# Altium schematic sheet pca63557_sheet1_connectors.SchDoc: =BoardTitle
size A4; Organization: Nordic Semiconductor; DocumentNumber: 1; SheetNumber: 1; SheetTotal: 4; CompanyName: Nordic Semiconductor; DocumentSize: A4
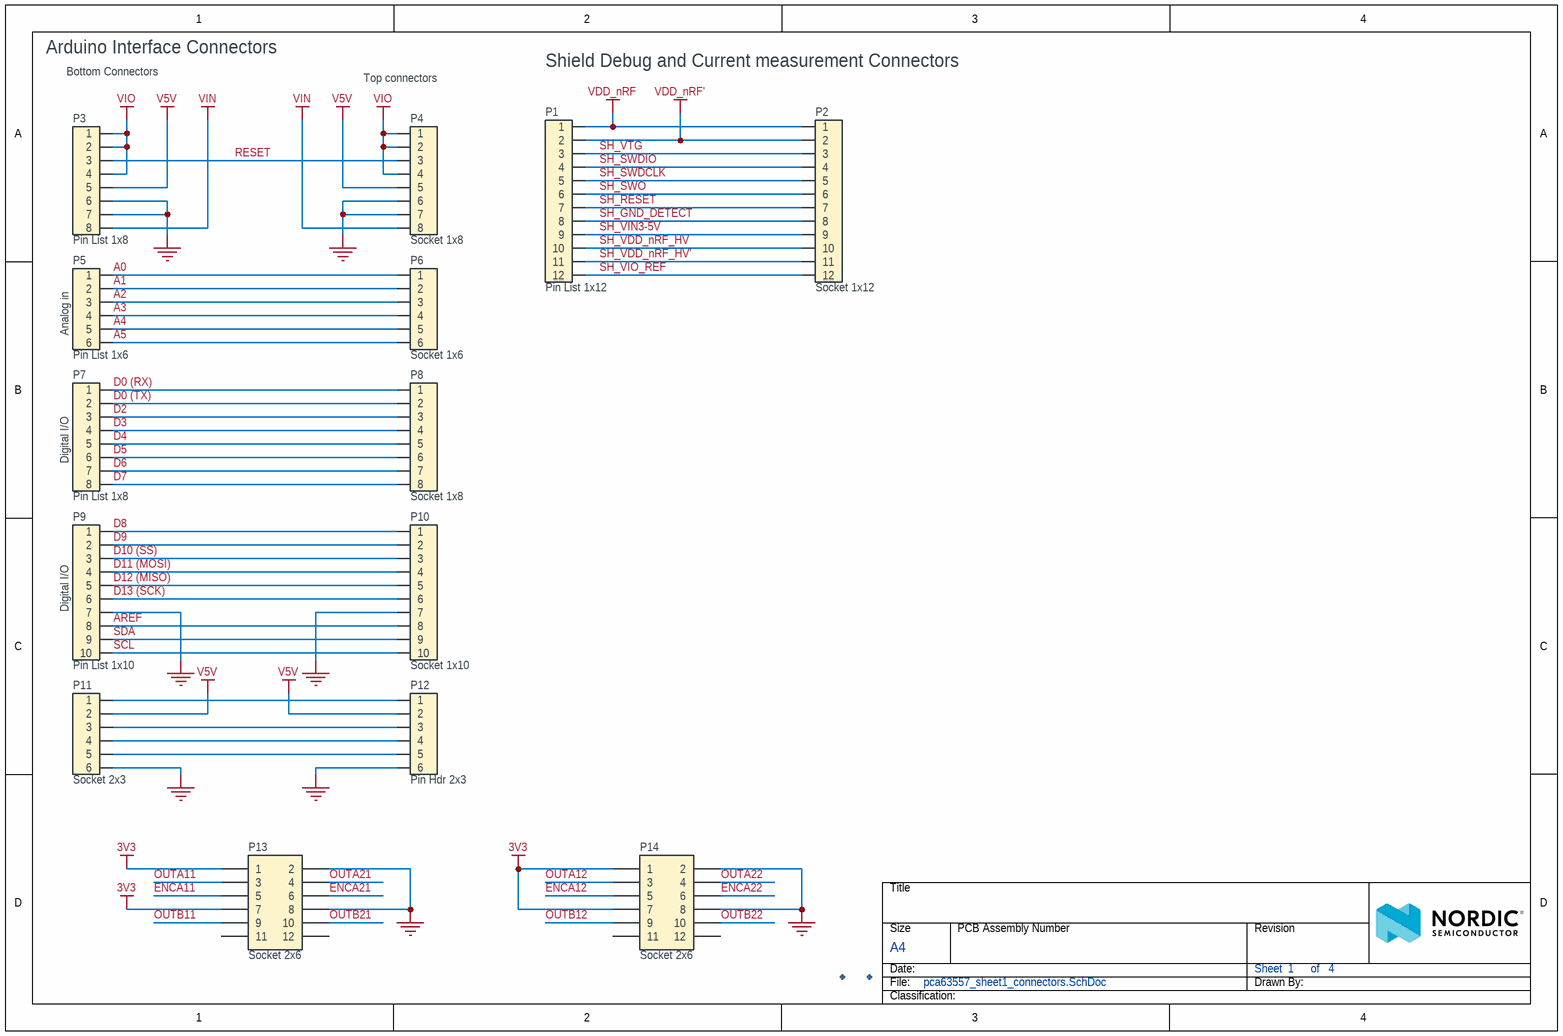
[diagram p0: pca63557_sheet1_connectors.SchDoc]

## Parts
Fid1  Fiducial mark  [Fiducial]  (value not drawn)
Fid2  Fiducial mark  [Fiducial]  (value not drawn)
P1  Pin List 1x12  [LIST_1x12_SMD]
P2  Socket 1x12  [SOCKET_1x12_SMD]
P3  Pin List 1x8  [LIST_1x8_SMD]
P4  Socket 1x8  [SOCKET_1x8_SMD]
P5  Pin List 1x6  [LIST_1x6_SMD]
P6  Socket 1x6  [SOCKET_1x6_SMD]
P7  Pin List 1x8  [LIST_1x8_SMD]
P8  Socket 1x8  [SOCKET_1x8_SMD]
P9  Pin List 1x10  [LIST_1x10_SMD]
P10  Socket 1x10  [SOCKET_1x10_SMD]
P11  Socket 2x3  [SOCKET_2x3_SMD-2.54mm-bottom]
P12  Pin Hdr 2x3  [HDR_2x3-SMD]
P13  Socket 2x6  [SOCKET_2x6_TH_ANG_2.54]
P14  Socket 2x6  [SOCKET_2x6_TH_ANG_2.54]

## Nets
3V3: P13.1 P13.7 P14.1 P14.7
GND: P3.6 P3.7 P4.6 P4.7 P9.7 P10.7 P11.6 P12.6 P13.2 P13.8 P14.2 P14.8
V5V: P3.5 P4.5 P11.2 P12.2
VDD_nRF: P1.1 P2.1
VDD_nRF': P1.2 P2.2
VIN: P3.8 P4.8
VIO: P3.1 P3.2 P3.4 P4.1 P4.2 P4.4
A0: P5.1 P6.1
A1: P5.2 P6.2
A2: P5.3 P6.3
A3: P5.4 P6.4
A4: P5.5 P6.5
A5: P5.6 P6.6
AREF: P9.8 P10.8
D0 (RX): P7.1 P8.1
D0 (TX): P7.2 P8.2
D2: P7.3 P8.3
D3: P7.4 P8.4
D4: P7.5 P8.5
D5: P7.6 P8.6
D6: P7.7 P8.7
D7: P7.8 P8.8
D8: P9.1 P10.1
D9: P9.2 P10.2
D10 (SS): P9.3 P10.3
D11 (MOSI): P9.4 P10.4
D12 (MISO): P9.5 P10.5
D13 (SCK): P9.6 P10.6
ENCA11: P13.5
ENCA12: P14.5
ENCA21: P13.6
ENCA22: P14.6
OUTA11: P13.3
OUTA12: P14.3
OUTA21: P13.4
OUTA22: P14.4
OUTB11: P13.9
OUTB12: P14.9
OUTB21: P13.10
OUTB22: P14.10
RESET: P3.3 P4.3
SCL: P9.10 P10.10
SDA: P9.9 P10.9
SH_GND_DETECT: P1.8 P2.8
SH_RESET: P1.7 P2.7
SH_SWDCLK: P1.5 P2.5
SH_SWDIO: P1.4 P2.4
SH_SWO: P1.6 P2.6
SH_VDD_nRF_HV: P1.10 P2.10
SH_VDD_nRF_HV': P1.11 P2.11
SH_VIN3-5V: P1.9 P2.9
SH_VIO_REF: P1.12 P2.12
SH_VTG: P1.3 P2.3
NetP11_1: P11.1 P12.1
NetP11_3: P11.3 P12.3
NetP11_4: P11.4 P12.4
NetP11_5: P11.5 P12.5

Not connected (* = marked no-connect by the designer): P13 11 12; P14 11 12

## Notes on the sheet
- Arduino Interface Connectors
- Bottom Connectors
- (near P4) Top connectors
- Shield Debug and Current measurement Connectors
- (near P5) Analog in
- (near P7) Digital I/O
- (near P9) Digital I/O
- Title
- Size
- Date:
- File:
- A4
- PCB Assembly Number
- Sheet         of
- Drawn By:
- Revision
- Classification:

## Library data of the parts
Fid1 Fid2 = Fid-Mark: Manufacturer: N.A.; Part number NEMS: 100500073; Value: N.A.; Pad Count: 1; Component Status: Active; Part Number: Fid-Mark; Manufacturer Part Number: N.A.; LatestRevisionDate: 2009-12-12; Published: 2009-12-12; Note: N.A.; Artikkelnr Noca: N.A.; Footprint Doc: Fiducial; PartId: 100500073; Component Class: Connectors; Author: rsk; ComponentLink1URL: N.A.; ComponentLink1Description: Datasheet; ComponentLink2URL: N.A.; ComponentLink2Description: Supplier link; HelpURL: N.A.; Supplier 1: N.A.; Supplier Part Number 1: N.A.; Supplier 2: N.A.; Supplier Part Number 2: N.A.; Part number IPS: N.A.; Part number Norautron: N.A.
P1 = Pin List 1x12 SMD: Pin List 1x12, 2.54mm (100mil), SMD; Manufacturer: W-CON; Manufacturer Part Number: 1125-1112S0M116R2; Part number IPS: 00000009969; Part number NEMS: 100500343; Component Status: Active; Pad Count: 12; Note: N.A.; Artikkelnr Noca: 55019293; Part Number: Pin List 1x12 SMD; PartId: 100500343; Component Class: Connectors; Author: rsk; ComponentLink1URL: N.A.; ComponentLink1Description: Datasheet; ComponentLink2URL: N.A.; ComponentLink2Description: Supplier link; HelpURL: N.A.; Footprint Doc: LIST_1x12_SMD; LatestRevisionDate: 2017-10-23; Published: 2015-11-10; Value: Pin List 1x12; Supplier 1: Cabcon; Supplier Part Number 1: 1125-1112S0M116R2; Supplier 2: Samtec; Supplier Part Number 2: TSM-112-01-L-SV-P-TR; Part number Norautron: N.A.
P2 = Socket 1x12 SMD: Socket 1x12, 2.54mm (100mil), SMD; Manufacturer: W-CON; Manufacturer Part Number: 2171-112MS0CUNR1; Part number NEMS: 100500420; Component Status: Active; Pad Count: 12; Note: N.A.; Part Number: Socket 1x12 SMD; PartId: 100500420; Component Class: Connectors; Author: rsk; ComponentLink1URL: N.A.; ComponentLink1Description: Datasheet; ComponentLink2URL: N.A.; ComponentLink2Description: Supplier link; HelpURL: N.A.; Footprint Doc: SOCKET_1x12_SMD; LatestRevisionDate: 2017-10-23; Published: 2016-07-07; Value: Socket 1x12; Supplier 1: Cabcon; Supplier Part Number 1: 2171-112MS0CUNR1; Supplier 2: Samtec; Supplier Part Number 2: SSM-112-L-SV-P-TR; Artikkelnr Noca: N.A.; Part number IPS: N.A.; Part number Norautron: N.A.
P3 P7 = Pin List 1x8 SMD: Pin List 1x8, 2.54mm (100mil), SMD; Manufacturer: W-CON; Manufacturer Part Number: 1125-1108S0M116R2; Part number IPS: 00000001701; Part number NEMS: 100500329; Note: N.A.; Artikkelnr Noca: 55010006; Component Status: Active; Pad Count: 8; Part Number: Pin List 1x8 SMD; LatestRevisionDate: 2016-01-22; Published: 2016-01-22; Value: Pin List 1x8; Footprint Doc: LIST_1x8_SMD; PartId: 100500329; Component Class: Connectors; Author: rsk; ComponentLink1URL: N.A.; ComponentLink1Description: Datasheet; ComponentLink2URL: N.A.; ComponentLink2Description: Supplier link; HelpURL: \\hizz\pro\app9717\Datasheet\connectors\W-CON\1125-11XXXXMXXXXX.pdf; Supplier 1: Cabcon; Supplier Part Number 1: 1125-1108S0M116R2; Supplier 2: Samtec; Supplier Part Number 2: TSM-108-01-L-SV-P-TR; Part number Norautron: N.A.
P4 P8 = Socket 1x8 SMD: Socket 1x8, 2.54mm (100mil), SMD; Manufacturer: W-CON; Manufacturer Part Number: 2171-108MS0CUNR1; Part number IPS: 00000009963; Part number Norautron: 26032369; Part number NEMS: 100500412; Note: N.A.; Artikkelnr Noca: 55030002; Component Status: Active; Pad Count: 8; Part Number: Socket 1x8 SMD; LatestRevisionDate: 2017-10-23; Published: 2016-01-22; Value: Socket 1x8; Footprint Doc: SOCKET_1x8_SMD; PartId: 100500412; Component Class: Connectors; Author: rsk; ComponentLink1URL: N.A.; ComponentLink1Description: Datasheet; ComponentLink2URL: N.A.; ComponentLink2Description: Supplier link; HelpURL: N.A.; Supplier 1: Cabcon; Supplier Part Number 1: 2171-108MS0CUNR1; Supplier 2: Samtec; Supplier Part Number 2: SSM-108-F-SV-P-TR
P5 = Pin List 1x6 SMD: Pin List 1x6, 2.54mm (100mil), SMD; Manufacturer: W-CON; Manufacturer Part Number: 1125-1106S0M116R2; Part number NEMS: 100500320; Note: N.A.; Artikkelnr Noca: 55010026; Component Status: Active; Pad Count: 6; Part Number: Pin List 1x6 SMD; LatestRevisionDate: 2016-03-29; Published: 2016-03-29; Value: Pin List 1x6; Footprint Doc: LIST_1x6_SMD; PartId: 100500320; Component Class: Connectors; Author: rsk; ComponentLink1URL: N.A.; ComponentLink1Description: Datasheet; ComponentLink2URL: N.A.; ComponentLink2Description: Supplier link; HelpURL: \\hizz\pro\app9717\Datasheet\connectors\W-CON\1125-11XXXXMXXXXX.pdf; Supplier 1: Cabcon; Supplier Part Number 1: 1125-1106S0M116R2; Supplier 2: Samtec; Supplier Part Number 2: TSM-106-01-L-SV-P-TR; Part number IPS: N.A.; Part number Norautron: N.A.
P6 = Socket 1x6 SMD: Socket 1x6, 2.54mm (100mil), SMD; Manufacturer: W-CON; Manufacturer Part Number: 2171-106MS0CUNR1; Part number IPS: 00000009964; Part number Norautron: 26032370; Part number NEMS: 100500408; Note: N.A.; Artikkelnr Noca: 55030001; Component Status: Active; Pad Count: 6; Part Number: Socket 1x6 SMD; LatestRevisionDate: 2017-10-23; Published: 2016-01-22; Value: Socket 1x6; Footprint Doc: SOCKET_1x6_SMD; PartId: 100500408; Component Class: Connectors; Author: rsk; ComponentLink1URL: N.A.; ComponentLink1Description: Datasheet; ComponentLink2URL: N.A.; ComponentLink2Description: Supplier link; HelpURL: N.A.; Supplier 1: Cabcon; Supplier Part Number 1: 2171-106MS0CUNR1; Supplier 2: Samtec; Supplier Part Number 2: SSM-106-F-SV-P-TR
P9 = Pin List 1x10 SMD: Pin List 1x10, 2.54mm (100mil), SMD; Manufacturer: W-CON; Manufacturer Part Number: 1125-1110S0M116R2; Part number IPS: 00000004906; Part number NEMS: 100500337; Note: N.A.; Artikkelnr Noca: 55010028; Component Status: Active; Pad Count: 10; Part Number: Pin List 1x10 SMD; LatestRevisionDate: 2016-03-29; Published: 2016-03-29; Value: Pin List 1x10; Footprint Doc: LIST_1x10_SMD; PartId: 100500337; Component Class: Connectors; Author: rsk; ComponentLink1URL: N.A.; ComponentLink1Description: Datasheet; ComponentLink2URL: N.A.; ComponentLink2Description: Supplier link; HelpURL: \\hizz\pro\app9717\Datasheet\connectors\W-CON\1125-11XXXXMXXXXX.pdf; Supplier 1: Cabcon; Supplier Part Number 1: 1125-1110S0M116R2; Supplier 2: Samtec; Supplier Part Number 2: TSM-110-01-L-SV-P-TR; Part number Norautron: N.A.
P10 = Socket 1x10 SMD: Socket 1x10, 2.54mm (100mil), SMD; Manufacturer: W-CON; Manufacturer Part Number: 2171-110MS0CUNR1; Part number IPS: 00000009965; Part number Norautron: 26032371; Part number NEMS: 100500416; Note: N.A.; Artikkelnr Noca: 55030004; Component Status: Active; Pad Count: 10; Part Number: Socket 1x10 SMD; LatestRevisionDate: 2016-01-22; Published: 2016-01-22; Value: Socket 1x10; Footprint Doc: SOCKET_1x10_SMD; PartId: 100500416; Component Class: Connectors; Author: rsk; ComponentLink1URL: N.A.; ComponentLink1Description: Datasheet; ComponentLink2URL: N.A.; ComponentLink2Description: Supplier link; HelpURL: N.A.; Supplier 1: Cabcon; Supplier Part Number 1: 2171-110MS0CUNR1; Supplier 2: Samtec; Supplier Part Number 2: SSM-110-F-SV-P-TR
P11 = Socket 2x3 SMD Bottom: Socket 2x3, 2.54mm (100mil), SMD; Manufacturer: W-CON; Manufacturer Part Number: 2171-203MS0CUNR1; Part number IPS: 00000004907; Part number NEMS: 100500433; Note: N.A.; Artikkelnr Noca: 55030010; Component Status: Active; Pad Count: 6; Part Number: Socket 2x3 SMD Bottom; LatestRevisionDate: 2016-03-29; Published: 2014-06-10; Value: Socket 2x3; Footprint Doc: SOCKET_2x3_SMD-2.54mm-bottom; PartId: 100500433; Component Class: Connectors; Author: rsk; ComponentLink1URL: N.A.; ComponentLink1Description: Datasheet; ComponentLink2URL: N.A.; ComponentLink2Description: Supplier link; HelpURL: \\hizz\pro\app9717\Datasheet\connectors\W-CON\2171-2XXMXXCUNXX.pdf; Supplier 1: Cabcon; Supplier Part Number 1: 2171-203MS0CUNR1; Supplier 2: Samtec; Supplier Part Number 2: SSM-103-F-DV-P-TR; Part number Norautron: N.A.
P12 = Pin Header 2x3 SMD: Pin Header 2x3, 2.54mm (100mil) SMD; Manufacturer: W-CON; Manufacturer Part Number: 1125-1203S0M116R1; Part number IPS: 00000009966; Part number Norautron: N.A.; Part number NEMS: 100500242; Artikkelnr Noca: 55010007; Component Status: Active; Pad Count: 6; Part Number: Pin Header 2x3 SMD; LatestRevisionDate: 2016-01-22; Published: 2016-01-22; Value: Pin Hdr 2x3; Note: SMD; Footprint Doc: HDR_2x3-SMD; PartId: 100500242; Component Class: Connectors; Author: rsk; ComponentLink1URL: N.A.; ComponentLink1Description: Datasheet; ComponentLink2URL: N.A.; ComponentLink2Description: Supplier link; HelpURL: \\hizz\pro\app9717\Datasheet\connectors\W-CON\1125-12XXXXMXXXXX.PDF; Supplier 1: Cabcon; Supplier Part Number 1: 1125-1203S0M116R1; Supplier 2: Samtec; Supplier Part Number 2: TSM-103-01-L-DV
P13 P14 = Socket 2x6 SMD Right-angle: 12 Position Header Connector 0.100" (2.54mm) Through Hole, Right Angle Gold; Manufacturer: Sullins Connector Solutions; Manufacturer Part Number: PPPC062LJBN-RC; Component Status: Active; Pad Count: 12; Note: N.A.; Assembly: DNM; Part Number: Socket 2x6 SMD Right-angle; Component Class: Connectors; Author: mam1; ComponentLink1URL: https://drawings-pdf.s3.amazonaws.com/10494.pdf; ComponentLink1Description: Datasheet; ComponentLink2URL: https://www.digikey.no/no/products/detail/sullins-connector-solutions/PPPC062LJBN-RC/776017; ComponentLink2Description: Supplier link; HelpURL: N.A.; Footprint Doc: SOCKET_2x6_TH_ANG_2.54; LatestRevisionDate: 2022-06-21; Published: 2022-06-21; Value: Socket 2x6; Supplier 1: Digi-Key; Supplier Part Number 1: S5559-ND; Supplier 2: N.A.; Supplier Part Number 2: N.A.; Artikkelnr Noca: N.A.; Part number IPS: N.A.; Part number Norautron: N.A.